# EAGLE design PEACM1 (EAGLE 6.5.0)
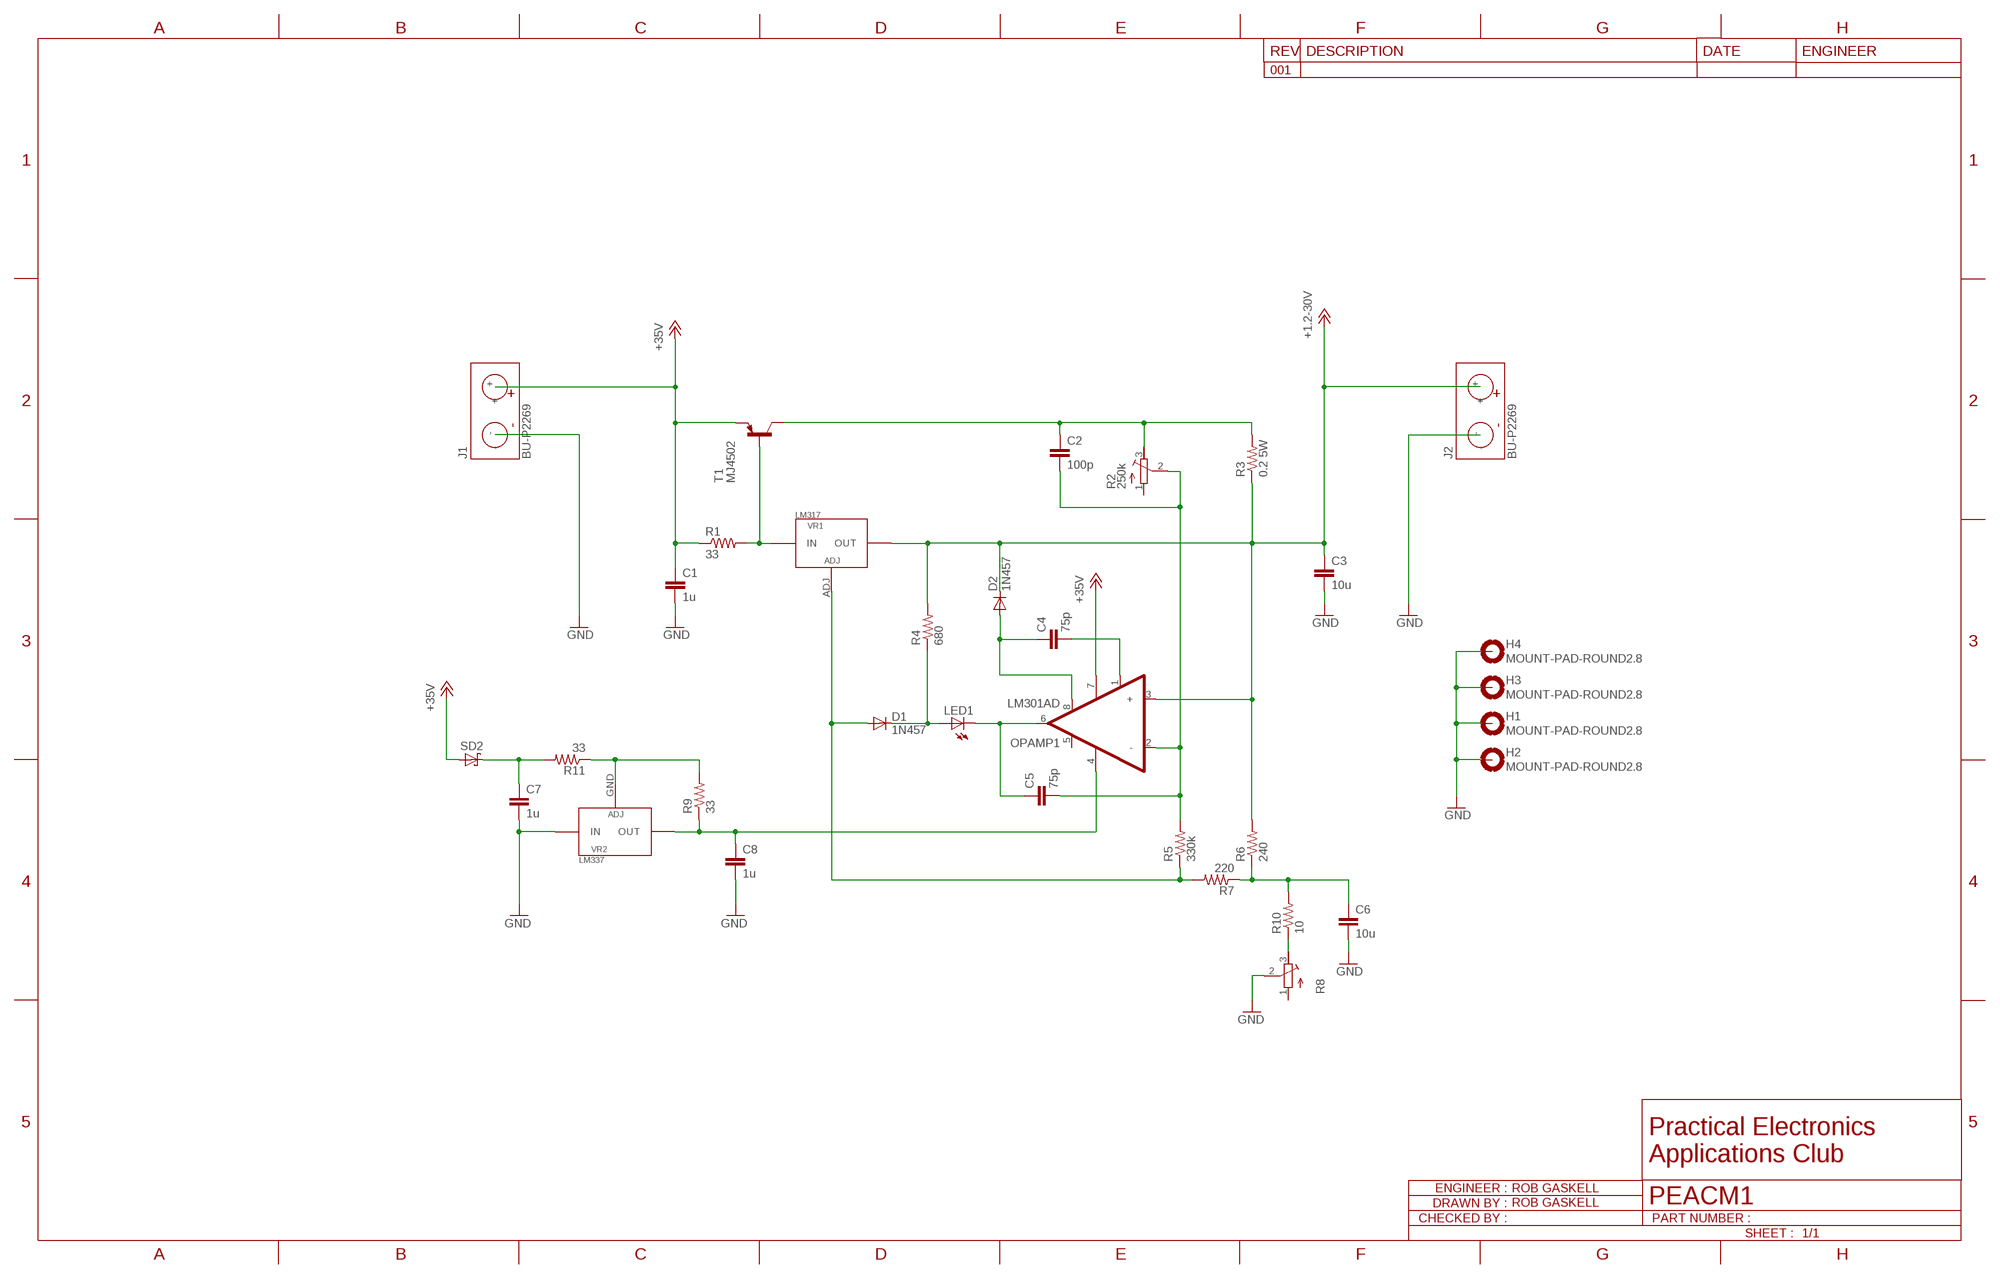
[diagram p0: schematic, sheet 1]

## Parts
C1  1u  C-EUC0805  [C0805]
C2  100p  C-EUC0805  [C0805]
C3  10u  C-EUC0805  [C0805]
C4  75p  C-EUC0805  [C0805]
C5  75p  C-EUC0805  [C0805]
C6  10u  C-EUC0805  [C0805]
C7  1u  C-EUC0805  [C0805]
C8  1u  C-EUC0805  [C0805]
D1  1N457  DIODE-DO35-10  [DO35-10]
D2  1N457  DIODE-DO35-10  [DO35-10]
H1  MOUNT-PAD-ROUND2.8  [2,8-PAD]
H2  MOUNT-PAD-ROUND2.8  [2,8-PAD]
H3  MOUNT-PAD-ROUND2.8  [2,8-PAD]
H4  MOUNT-PAD-ROUND2.8  [2,8-PAD]
J1  BU-P2269  [BU-P2269]
J2  BU-P2269  [BU-P2269]
LED1  LEDCHIPLED_1206  [CHIPLED_1206]
OPAMP1  LM301AD  [SOIC8]
R1  33  R-US_M1206  [M1206]
R2  250k  R-TRIMM4G/J  [RTRIM4G/J]
R3  0.2 5W  R-US_R4527  [R4527]
R4  680  R-US_M1206  [M1206]
R5  330k  R-US_M1206  [M1206]
R6  240  R-US_R1206  [R1206]
R7  220  R-US_R1206  [R1206]
R8  R-TRIMM4G/J  [RTRIM4G/J]
R9  33  R-US_M1206  [M1206]
R10  10  R-US_R1206  [R1206]
R11  33  R-US_M1206  [M1206]
SD2  STPS0540Z  [SOD-123]
T1  MJ4502  -PNP-TO3  [TO3]
VR1  LM317  [D2PAK-3]
VR2  LM337  [DPAK(TO-252)]

## Nets
+1.2-30V: C3.1 D2.C J2.+ OPAMP1.3(+) R3.1 R4.2 R6.2 VR1.VOUT(OUT)
+35V: C1.1 J1.+ OPAMP1.7(VCC+) R1.1 SD2.A T1.E
EMITTER_RES: C2.1 R2.3(E) R3.2 T1.C
GND: C1.2 C3.2 C6.2 C7.2 C8.2 H1.B2,8(MOUNT) H2.B2,8(MOUNT) H3.B2,8(MOUNT) H4.B2,8(MOUNT) J1.- J2.- R8.2(S) VR2.INPUT(IN)
N$1: C4.2 OPAMP1.1(BAL#1)
N$2: C7.1 R11.2 SD2.C
N$3: R1.2 T1.B VR1.VIN(IN)
N$4: C2.2 C5.2 OPAMP1.2(-) R2.2(S) R5.2
N$5: D1.A R5.1 R7.2 VR1.ADJ
N$6: R8.3(E) R10.1
N$7: C6.1 R6.1 R7.1 R10.2
N$8: D1.C LED1.A R4.1
N$9: C4.1 D2.A OPAMP1.8(BAL)
N$11: C5.1 LED1.C OPAMP1.6(OUT_A)
SCH_RES_VCC-: R9.2 R11.1 VR2.GND(ADJ)
VCC-: C8.1 OPAMP1.4(VCC-) R9.1 VR2.OUTPUT(OUT)
Unconnected: OPAMP1.5(BAL) R2.1(A) R8.1(A)

## Library data of the parts
C1-C8 = rcl:C-EU: CAPACITOR, European symbol
D1 D2 = diode:DIODE-: DIODE
H1-H4 = holes:MOUNT-PAD-ROUND: MOUNTING PAD, round
J1 J2 = PEAC:BU-P2269
LED1 = led:LED: LED OSRAM: - CHIPLED LG R971, LG N971, LY N971, LG Q971, LY Q971, LO R971, LY R971 LH N974, LH R974 LS Q976, LO Q976, LY Q976 LO Q996 - Hyper CHIPLED LW Q18S LB Q993, LB Q99A, LB R99A - SideLED LS A670, LO A670, LY A670, LG A670, LP A670 LB A673, LV A673, LT A673, LW A673 LH A674 LY A675 LS A676, LA A676, LO A676, LY A676, LW A676 LS A679, LY A679, LG A679 - Hyper Micro SIDELED® LS Y876, LA Y876, LO Y876, LY Y876 LT Y87S - SmartLED LW L88C, LW L88S LB L89C, LB L89S, LG L890 LS L89K, LO L89K, LY L89K LS L896, LA L896, LO L896, LY L896 - TOPLED LS T670, LO T670, LY T670, LG T670, LP T670 LSG T670, LSP T670, LSY T670, LOP T670, LYG T670 LG T671, LOG T671, LSG T671 LB T673, LV T673, LT T673, LW T673 LH T674 LS T676, LA T676, LO T676, LY T676, LB T676, LH T676, LSB T676, LW T676 LB T67C, LV T67C, LT T67C, LS T67K, LO T67K, LY T67K, LW E67C LS E67B, LA E67B, LO E67B, LY E67B, LB E67C, LV E67C, LT E67C LW T67C LS T679, LY T679, LG T679 LS T770, LO T770, LY T770, LG T770, LP T770 LB T773, LV T773, LT T773, LW T773 LH T774 LS E675, LA E675, LY E675, LS T675 LS T776, LA T776, LO T776, LY T776, LB T776 LHGB T686 LT T68C, LB T68C - Hyper Mini TOPLED® LB M676 - Mini TOPLED Santana® LG M470 LS M47K, LO M47K, LY M47K Source: http://www.osram.convergy.de LUXEON: - LUMILED® LXK2-PW12-R00, LXK2-PW12-S00, LXK2-PW14-U00, LXK2-PW14-V00 LXK2-PM12-R00, LXK2-PM12-S00, LXK2-PM14-U00 LXK2-PE12-Q00, LXK2-PE12-R00, LXK2-PE12-S00, LXK2-PE14-T00, LXK2-PE14-U00 LXK2-PB12-K00, LXK2-PB12-L00, LXK2-PB12-M00, LXK2-PB14-N00, LXK2-PB14-P00, LXK2-PB14-Q00 LXK2-PR12-L00, LXK2-PR12-M00, LXK2-PR14-Q00, LXK2-PR14-R00 LXK2-PD12-Q00, LXK2-PD12-R00, LXK2-PD12-S00 LXK2-PH12-R00, LXK2-PH12-S00 LXK2-PL12-P00, LXK2-PL12-Q00, LXK2-PL12-R00 Source: www.luxeon.com KINGBRIGHT: KA-3528ASYC Source: www.kingbright.com
OPAMP1 = PEAC:LM301A
R1 R3-R7 R9-R11 = rcl:R-US_: RESISTOR, American symbol
R2 R8 = rcl:R-TRIMM: Trimm resistor
SD2 = motorFeedback:STPS0540Z
T1 = transistor:*-PNP-: PNP Transistror
VR1 = PEAC:LM317
VR2 = PEAC:LM337

## Board
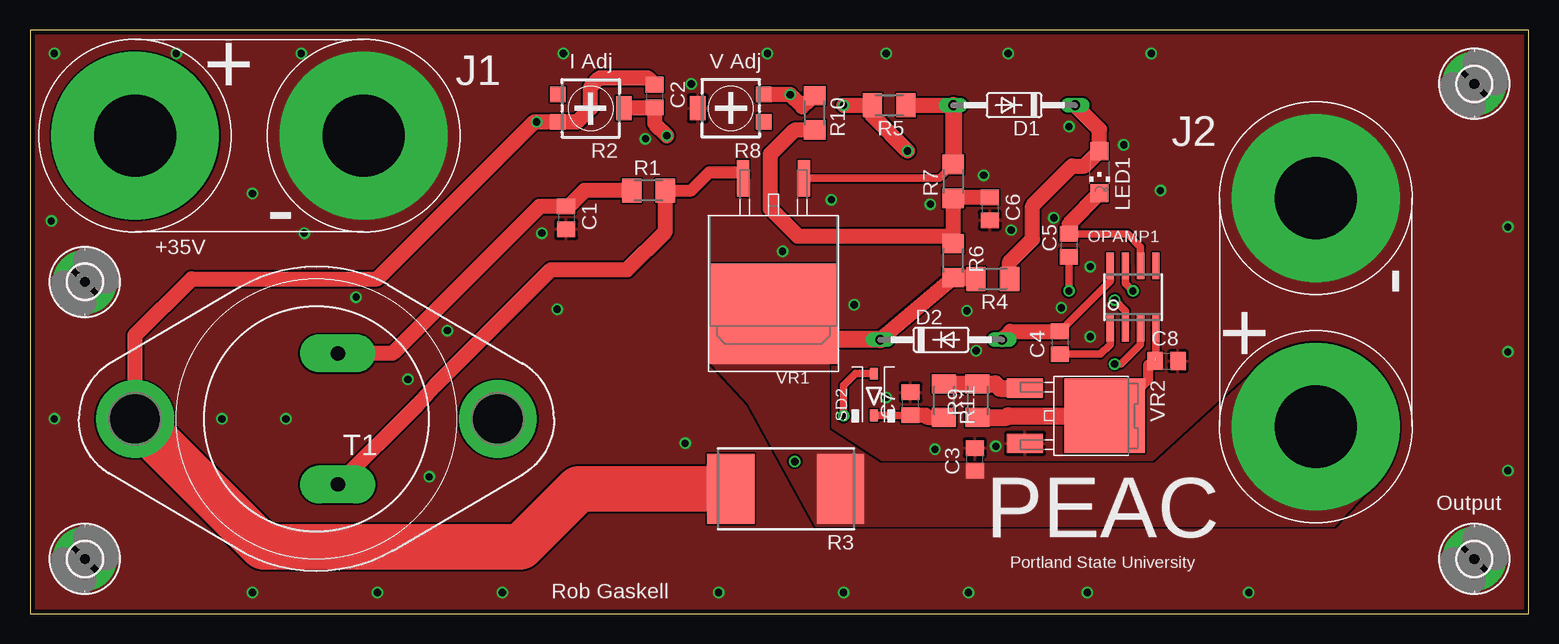
[diagram p1: board, top side]
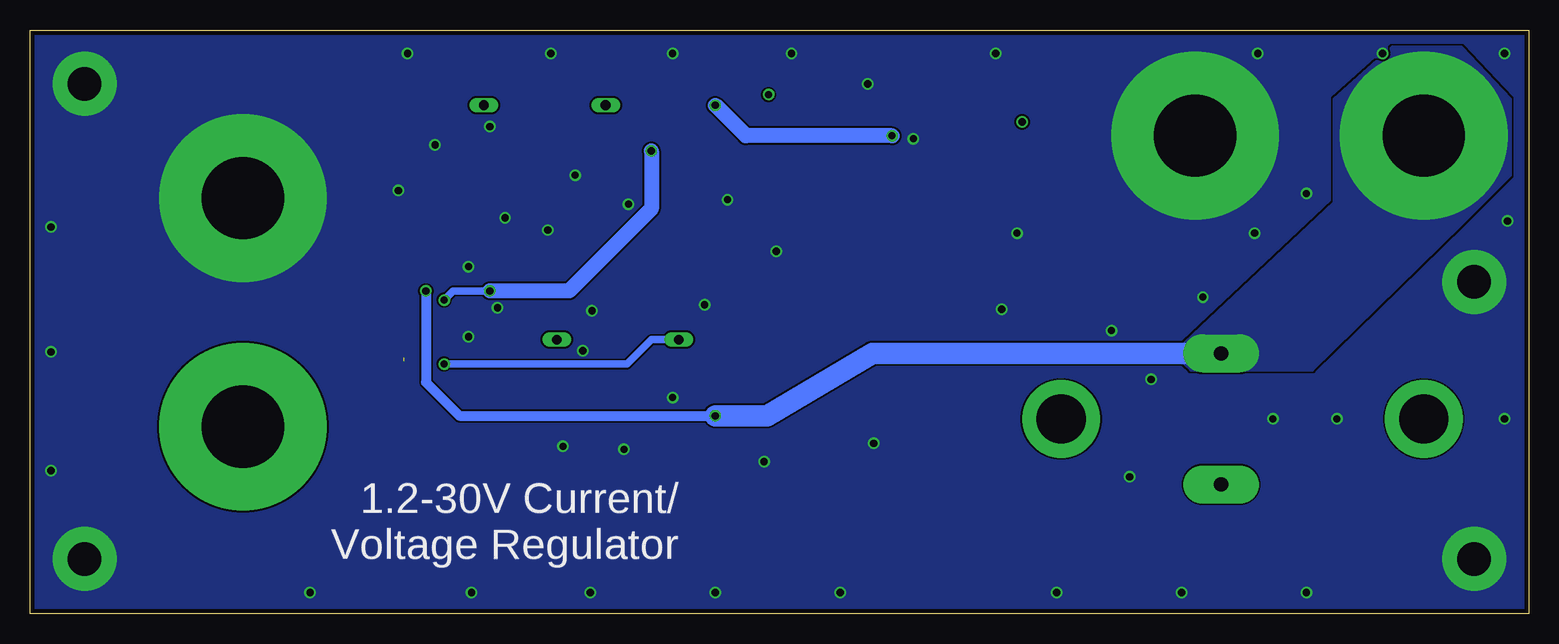
[diagram p2: board, bottom side, seen from below]

Size 124.95 x 48.69 mm. Coordinates in mm from the lower left corner, seen from the top.
Outline: 0,0 124.95,0 124.95,48.69 0,48.69 0,0
Copper layers (1*16): Top 0.0356mm / dielectric 1.5011mm / Bottom 0.0356mm
Design rules "osh-park-2layer": minimum track width 6mil, minimum drill 13mil, track to track 6mil, track to pad 6mil, pad to pad 6mil, via to via 6mil, smd to smd 6mil, copper to edge 15mil, drill to drill 6mil, minimum pad ring 7mil, minimum via ring 7mil, stop-mask expansion 3mil, vias tented up to drill 0mil, thermal gap 10mil

### Footprints (pad centres in the part's own frame; a part is rotated, then mirrored left to right if it is on the bottom)
C0805 = smd 1.3 x 1.5: 1 -0.95,0; 2 0.95,0
DO35-10 = drill 0.813 long: A 5.08,0; C -5.08,0
2,8-PAD = drill 2.8 pad 5.334: B2,8 0,0
BU-P2269 = drill 6.858 pad 13.97: + -9.525,0; - 9.525,0
CHIPLED_1206 = smd 1.5 x 1.5: A 0,-1.75; C 0,1.75
SOIC8 = smd 0.6 x 2.2: 1 -1.905,-2.6; 2 -0.635,-2.6; 3 0.635,-2.6; 4 1.905,-2.6; 5 1.905,2.6; 6 0.635,2.6; 7 -0.635,2.6; 8 -1.905,2.6
M1206 = smd 1.6 x 2: 1 -1.4,0; 2 1.4,0
RTRIM4G/J = smd 1.3 x 1.3: 1 -1.15,-2.75; 3 1.15,-2.75 | smd 2 x 1.3: 2 0,2.75
R4527 = smd 3.94 x 5.84: 1 -4.575,0; 2 4.575,0
R1206 = smd 1.6 x 1.803: 1 -1.422,0; 2 1.422,0
SOD-123 = smd 0.97 x 0.65: A 1.74,0; C -1.74,0
TO3 = drill 1.194 pad 3.15 long: B -1.778,5.461; E -1.778,-5.461 | drill 4.115 pad 6.477: C 15.113,0; C/ -15.113,0
D2PAK-3 = smd 3.05 x 1.016: ADJ 7.12,-2.54; VIN 7.12,2.54 | smd 8.38 x 10.66: VOUT -4.19,0
DPAK(TO-252) = smd 3 x 1.6: GND 2.4,-2.3; INPUT 2.4,2.3 | smd 6.7 x 6.2: OUTPUT -4.25,0

### Placement (x,y rotation side)
C1  44.7,33.02 270 top
C2  52.07,43.18 270 top
C3  78.77,12.88 90 top
C4  85.85,22.61 270 top
C5  86.61,30.73 270 top
C6  80.01,33.78 270 top
C7  73.41,17.53 90 top
C8  94.74,21.08 0 top
D1  82.04,42.42 180 top
D2  75.95,22.86 0 top
H1  4.57,4.57 0 top
H2  120.4,44.2 0 top
H3  120.4,4.57 0 top
H4  4.57,27.69 0 top
J1  18.29,39.88 0 top
J2  107.19,25.15 90 top
LED1  89.15,36.83 180 top
OPAMP1  91.95,26.42 0 top
R1  51.56,35.31 0 top
R2  46.74,42.16 270 top
R3  62.99,10.41 180 top
R4  80.26,27.94 180 top
R5  71.63,42.42 180 top
R6  76.96,29.46 270 top
R7  76.96,36.07 90 top
R8  58.42,42.16 90 top
R9  78.99,17.78 90 top
R10  65.41,41.78 270 top
R11  76.2,17.78 270 top
SD2  70.36,18.29 90 top
T1  23.88,16.26 180 top
VR1  61.98,29.21 90 top
VR2  85.34,16.51 180 top

### Tracks (layer width: path | path; a pad name or v marks a point on that pad's centre or on a via)
+1.2-30V  (via drill 0.6)
  Top 0.61: OPAMP1.3 92.58,22.48 90.93,20.83 v90.42,20.83
  Top 1.27: R6.2 D2.C
  Top 1.422: R6.2 78.76,28.04 R4.2 | D2.C 64.14,22.86 VR1.VOUT
  Bottom 0.61: v90.42,20.83 75.18,20.83 73.15,22.86 D2.C
  pour Top (no thermals): 56.9,28.96 56.9,20.83 59.94,17.53 65.53,7.37 108.71,7.37 112.52,11.43 113.54,17.78 108.71,22.1 102.62,20.57 93.73,12.45 70.87,12.45 66.55,15.24 66.55,28.7
+35V  (via drill 0.6)
  Top 0.61: OPAMP1.7 91.31,27.56 v91.95,26.92 | v67.82,16.51 67.82,19.05 68.8,20.03 69.92,20.03 | 69.92,20.03 69.93,20.02 | 69.92,20.03 SD2.A
  Top 1.27: R1.1 46.23,35.31 44.89,33.97 C1.1 42.48,33.97 30.23,21.72 T1.E
  Bottom 0.813: v91.95,26.92 91.95,19.3 89.15,16.51 v67.82,16.51
  Bottom 1.778: T1.E 54.74,21.72 63.5,16.51 v67.82,16.51
  pour Bottom (no thermals): 5.59,47.24 11.43,47.24 16.26,42.93 16.26,34.29 28.7,22.61 28.7,20.83 28.19,20.32 18.03,20.32 5.59,32.51 1.52,36.58 1.52,42.93
EMITTER_RES  (via drill 0.6)
  Top 1.27: C2.1 51.5,44.7 47.5,44.7 46.74,43.94 46.74,42.16 45.59,41.01 R2.3 42.5,41.01 v42.24,41.02 42.04,41.02 28.96,27.94 13.46,27.94 8.76,23.24 T1.C
  Top 3.81: R3.2 45.72,10.41 40.89,5.59 19.43,5.59 T1.C
GND  (via drill 0.6)
  other vias: 27.18,26.42 94.23,35.31 85.34,33.02 80.52,13.97 55.12,44.2 2.03,46.74 1.78,32.77 93.47,46.74 2.03,16.26 12.19,46.74 22.61,46.74 44.45,46.74 61.47,46.74 71.37,46.74 81.53,46.74 123.19,32.26 123.19,21.84 123.19,11.94 101.6,1.78 18.54,1.78 57.4,1.78 28.96,1.78 39.37,1.78 67.82,1.78 78.23,1.78 88.14,1.78 42.67,31.75 43.94,25.4 16,16.26 21.34,16.26 63.75,12.7 54.61,14.22 18.54,35.05 91.19,39.12 75.44,13.72 79.5,36.58 88.39,28.96 88.39,23.11 81.79,32 86.61,40.64 78.87,21.95 71.37,18.03 85.98,25.53 78.11,25.27 75.06,34.16 68.71,25.78 33.27,11.43 31.5,19.56 34.8,23.62 62.74,30.23 66.8,34.54 22.86,31.75 51.31,39.62
  pour Top (rank 2): 0,48.77 124.97,48.77 124.97,0 0,0
  pour Bottom (rank 2): 0,48.77 0,0 124.97,0 124.97,48.77
N$1
  Top 0.61: OPAMP1.1 90.04,22.48 89.22,21.66 C4.2
N$2
  Top 0.61: SD2.C 73.41,16.55 C7.1
  Top 1.27: C7.1 74.68,16.58 74.68,16.51 74.81,16.38 R11.2
N$3
  Top 1.016: R1.2 55.12,35.31 56.64,36.83 59.44,36.83 VR1.VIN
  Top 1.27: T1.B 32.26,17.4 33.78,19.05 43.43,28.7 49.78,28.7 52.96,31.88 R1.2
N$4  (via drill 0.6)
  Top 0.61: C5.2 v86.61,26.92 | v90.42,26.16 91.31,25.27 OPAMP1.2
  Top 1.27: R2.2 49.55,42.23 C2.2 52.07,40.89 v53.09,39.88 | v67.82,42.42 R5.2 70.23,41.53 v73.15,38.61
  Bottom 0.61: v86.61,26.92 89.66,26.92 v90.42,26.16
  Bottom 1.27: v53.09,39.88 65.28,39.88 v67.82,42.42 | v73.15,38.61 73.15,33.78 80.01,26.92 v86.61,26.92
N$5
  Top 0.61: VR1.ADJ 75.8,36.33 R7.2
  Top 1.27: R5.1 D1.A
  Top 1.422: D1.A R7.2
N$6
  Top 1.27: R8.3 63.37,43.31 64.39,42.29 R10.1
N$7
  Top 1.27: R6.1 76.96,31.5 | 76.96,31.5 R7.1 arc-90 77.05,34.73 C6.1 | 76.96,31.5 64.01,31.5 61.72,33.78 61.72,38.35 63.78,40.36 R10.2
N$8
  Top 1.27: R4.1 81.66,29.34 83.57,31.24 83.57,34.04 86.87,37.34 87.91,37.34 LED1.A 89.15,40.39 D1.C
  Top 1.422: LED1.A 89.18,38.58
N$9
  Top 0.61: C4.1 90.04,27.75 OPAMP1.8
  Top 1.27: D2.A 81.72,23.56 C4.1
N$11
  Top 0.61: OPAMP1.6 92.58,30.61 91.51,31.68 C5.1
  Top 1.27: LED1.C 86.61,32.48 C5.1
N$12  (via drill 0.6)
  other vias: 63.37,43.31
SCH_RES_VCC-
  Top 1.422: R11.1 R9.2 80.46,19.18 80.83,18.81 VR2.GND
VCC-  (1 unrouted)
  Top 0.61: 90.42,16.76 89.85,16.76 VR2.OUTPUT | OPAMP1.4 93.85,21.4 93.79,21.34
  Top 0.813: 90.42,16.76 93.22,19.56 93.22,20.76 93.79,21.34
  Top 1.422: R9.1 81.4,16.38 81.53,16.51 VR2.OUTPUT

### Text on the board
tPlace: I Adj | V Adj | +35V | Output | PEAC | Portland State University | Rob Gaskell
bPlace: 1.2-30V Current/ / Voltage Regulator